# Altium schematic sheet ENC_SENSOR.schdoc
size 305 x 213 mm
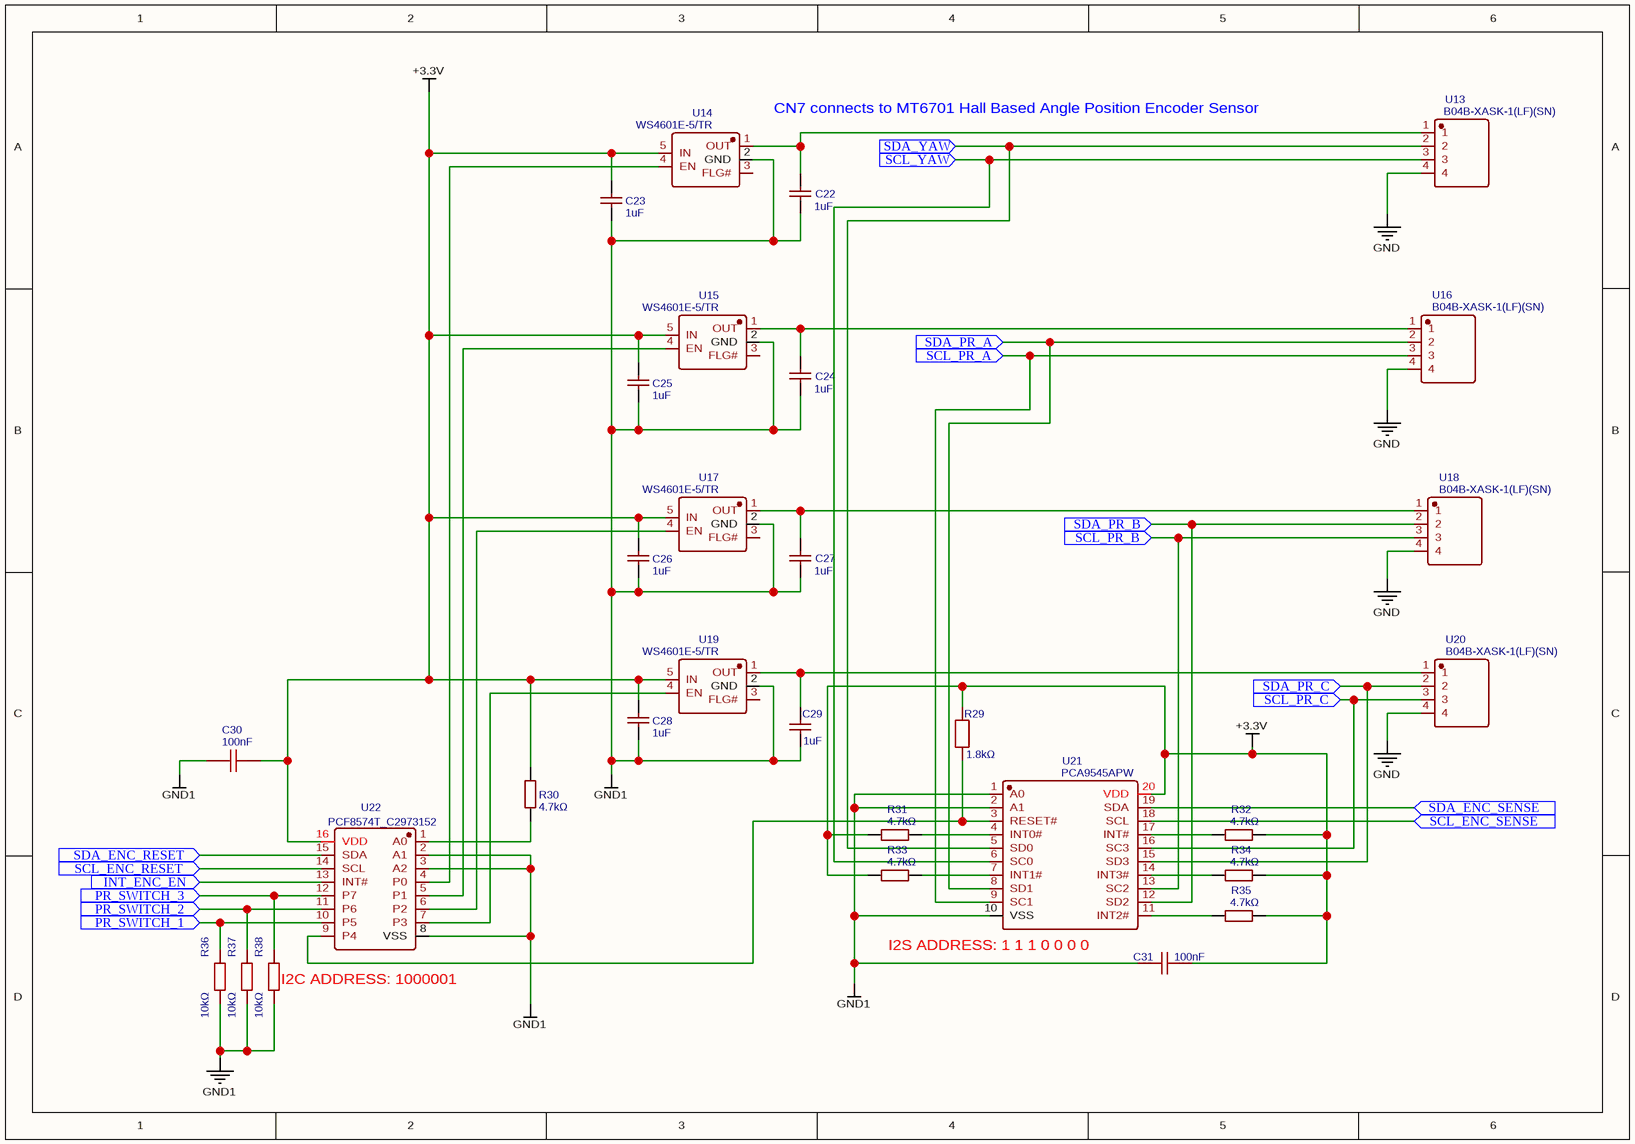
[diagram p0: ENC_SENSOR.schdoc]

## Parts
C22  1uF  [C1206]
C23  1uF  [C1206]
C24  1uF  [C1206]
C25  1uF  [C1206]
C26  1uF  [C1206]
C27  1uF  [C1206]
C28  1uF  [C1206]
C29  1uF  [C1206]
C30  100nF  [C0805]
C31  100nF  [C0805]
R29  1.8kΩ  [R0805]
R30  4.7kΩ  [R0805]
R31  4.7kΩ  [R0805]
R32  4.7kΩ  [R0805]
R33  4.7kΩ  [R0805]
R34  4.7kΩ  [R0805]
R35  4.7kΩ  [R0805]
R36  10kΩ  [R0805]
R37  10kΩ  [R0805]
R38  10kΩ  [R0805]
U13  B04B-XASK-1(LF)(SN)  [CONN-TH_B04B-XASK-1-LF-SN]
U14  WS4601E-5/TR  [SOT-23-5_L2.9-W1.6-P0.95-LS2.8-BL]
U15  WS4601E-5/TR  [SOT-23-5_L2.9-W1.6-P0.95-LS2.8-BL]
U16  B04B-XASK-1(LF)(SN)  [CONN-TH_B04B-XASK-1-LF-SN]
U17  WS4601E-5/TR  [SOT-23-5_L2.9-W1.6-P0.95-LS2.8-BL]
U18  B04B-XASK-1(LF)(SN)  [CONN-TH_B04B-XASK-1-LF-SN]
U19  WS4601E-5/TR  [SOT-23-5_L2.9-W1.6-P0.95-LS2.8-BL]
U20  B04B-XASK-1(LF)(SN)  [CONN-TH_B04B-XASK-1-LF-SN]
U21  PCA9545APW  [TSSOP-20_L6.5-W4.4-P0.65-LS6.4-BL]
U22  PCF8574T_C2973152  [SO-16_L10.3-W7.5-P1.27-LS10.3-BL]

## Ports
INT_ENC_EN (in), PR_SWITCH_1 (in), PR_SWITCH_2 (in), PR_SWITCH_3 (in), SCL_ENC_RESET (in), SCL_ENC_SENSE (in), SCL_PR_A (in), SCL_PR_B (in), SCL_PR_C (in), SCL_YAW (in), SDA_ENC_RESET (in), SDA_ENC_SENSE (in), SDA_PR_A (in), SDA_PR_B (in), SDA_PR_C (in), SDA_YAW (in)

## Nets
+3.3V: C23.1 C25.1 C26.1 C28.1 C30.1 C31.1 R29.2 R30.2 R31.1 R32.2 R33.1 R34.2 R35.2 U14.5(IN) U15.5(IN) U17.5(IN) U19.5(IN) U21.20(VDD) U22.16(VDD)
GND: U13.4 U16.4 U18.4 U20.4
GND1: C22.1 C23.2 C24.1 C25.2 C26.2 C27.1 C28.2 C29.1 C30.2 C31.2 R36.1 R37.1 R38.1 U14.2(GND) U15.2(GND) U17.2(GND) U19.2(GND) U21.1(A0) U21.2(A1) U21.10(VSS) U22.2(A1) U22.3(A2) U22.8(VSS)
INT_ENC_EN: U22.13(INT#) ; port INT_ENC_EN
PR_SWITCH_1: R36.2 U22.10(P5) ; port PR_SWITCH_1
PR_SWITCH_2: R37.2 U22.11(P6) ; port PR_SWITCH_2
PR_SWITCH_3: R38.2 U22.12(P7) ; port PR_SWITCH_3
SCL_ENC_RESET: U22.14(SCL) ; port SCL_ENC_RESET
SCL_ENC_SENSE: U21.18(SCL) ; port SCL_ENC_SENSE
SCL_PR_A: U16.3 U21.9(SC1) ; port SCL_PR_A
SCL_PR_B: U18.3 U21.13(SC2) ; port SCL_PR_B
SCL_PR_C: U20.3 U21.16(SC3) ; port SCL_PR_C
SCL_YAW: U13.3 U21.6(SC0) ; port SCL_YAW
SDA_ENC_RESET: U22.15(SDA) ; port SDA_ENC_RESET
SDA_ENC_SENSE: U21.19(SDA) ; port SDA_ENC_SENSE
SDA_PR_A: U16.2 U21.8(SD1) ; port SDA_PR_A
SDA_PR_B: U18.2 U21.12(SD2) ; port SDA_PR_B
SDA_PR_C: U20.2 U21.15(SD3) ; port SDA_PR_C
SDA_YAW: U13.2 U21.5(SD0) ; port SDA_YAW
NetC22_2: C22.2 U13.1 U14.1(OUT)
NetC24_2: C24.2 U15.1(OUT) U16.1
NetC27_2: C27.2 U17.1(OUT) U18.1
NetC29_2: C29.2 U19.1(OUT) U20.1
NetR29_1: R29.1 U21.3(RESET#) U22.9(P4)
NetR30_1: R30.1 U22.1(A0)
NetR31_2: R31.2 U21.4(INT0#)
NetR32_1: R32.1 U21.17(INT#)
NetR33_2: R33.2 U21.7(INT1#)
NetR34_1: R34.1 U21.14(INT3#)
NetR35_1: R35.1 U21.11(INT2#)
NetU14_4: U14.4(EN) U22.4(P0)
NetU15_4: U15.4(EN) U22.5(P1)
NetU17_4: U17.4(EN) U22.6(P2)
NetU19_4: U19.4(EN) U22.7(P3)

Not connected (* = marked no-connect by the designer): U14 3(FLG#); U15 3(FLG#); U17 3(FLG#); U19 3(FLG#)

## Notes on the sheet
- CN7 connects to MT6701 Hall Based Angle Position Encoder Sensor
- (near U21) I2S ADDRESS: 1 1 1 0 0 0 0
- (near R38) I2C ADDRESS: 1000001

## Library data of the parts
C22-C29 = 1uF: BOM_Manufacturer: YAGEO; BOM_Manufacturer Part: CC1206KKX7R8BB105; nameAlias: Capacitance; BOM_Supplier: LCSC; BOM_Supplier Part: C107184; BOM_JLCPCB Part Class: Extended Part; spicePre: C; spiceSymbolName: CC1206KKX7R8BB105
C30 C31 = 100nF: BOM_Manufacturer: YAGEO; BOM_Manufacturer Part: CC0805KRX7R8BB104; nameAlias: Capacitance; Contributor: LCSC; BOM_Supplier: LCSC; BOM_Supplier Part: C519981; BOM_JLCPCB Part Class: Extended Part; spicePre: C; spiceSymbolName: CC0805KRX7R8BB104
R29 = 1.8kΩ: BOM_Manufacturer: YAGEO; BOM_Manufacturer Part: RT0805BRE071K8L; nameAlias: Resistance (Ohms); Contributor: LCSC; BOM_Supplier: LCSC; BOM_Supplier Part: C513603; Resistance: 1.8kΩ; spicePre: R; spiceSymbolName: RT0805BRE071K8L
R30-R35 = 4.7kΩ: BOM_Manufacturer: UniOhm; BOM_Manufacturer Part: 0805W8J0472T5E; nameAlias: Resistance; Resistance (Ohms): 4.7K; BOM_Supplier: LCSC; BOM_Supplier Part: C26022; BOM_JLCPCB Part Class: Extended Part; spicePre: R; spiceSymbolName: 0805W8J0472T5E
R36-R38 = 10kΩ: BOM_Manufacturer: Ever Ohms Tech; BOM_Manufacturer Part: TR0805D10KP0550; Resistance (Ohms): 10K; nameAlias: Resistance; Contributor: LCSC; BOM_Supplier: LCSC; BOM_Supplier Part: C332266; BOM_JLCPCB Part Class: Extended Part; spicePre: R; spiceSymbolName: TR0805D10KP0550
U13 U16 U18 U20 = B04B-XASK-1(LF)(SN): BOM_Manufacturer: JST Sales America; Contributor: LCSC; BOM_Supplier: LCSC; BOM_Supplier Part: C264994; BOM_Manufacturer Part: B04B-XASK-1(LF)(SN); BOM_JLCPCB Part Class: Extended Part; spicePre: U; spiceSymbolName: B04B-XASK-1(LF)(SN)
U14 U15 U17 U19 = WS4601E-5/TR: BOM_Manufacturer: WILLSEMI(Will Semicon); Contributor: LCSC; BOM_Supplier: LCSC; BOM_Supplier Part: C213171; BOM_Manufacturer Part: WS4601E-5/TR; BOM_JLCPCB Part Class: Extended Part; spicePre: U; spiceSymbolName: WS4601E-5/TR
U21 = PCA9545APW: BOM_Manufacturer: NXP; Contributor: LCSC; BOM_Supplier: LCSC; BOM_Manufacturer Part: PCA9545APW; BOM_Supplier Part: C129515; BOM_JLCPCB Part Class: Extended Part; spicePre: U; spiceSymbolName: PCA9545APW
U22 = PCF8574T_C2973152: BOM_Manufacturer: NXP Semicon; BOM_Manufacturer Part: PCF8574T/3,518; Contributor: LCSC; BOM_Supplier: LCSC; BOM_Supplier Part: C7605; link: https://atta.szlcsc.com//upload/public/pdf/source/20190611/C398075_1925312D8618E19C6137781D5B71A3CA.pdf; BOM_JLCPCB Part Class: Extended Part; spicePre: U; spiceSymbolName: PCF8574T_C2973152